# Altium schematic sheet 1.Quectel_BG96.SchDoc
size A4
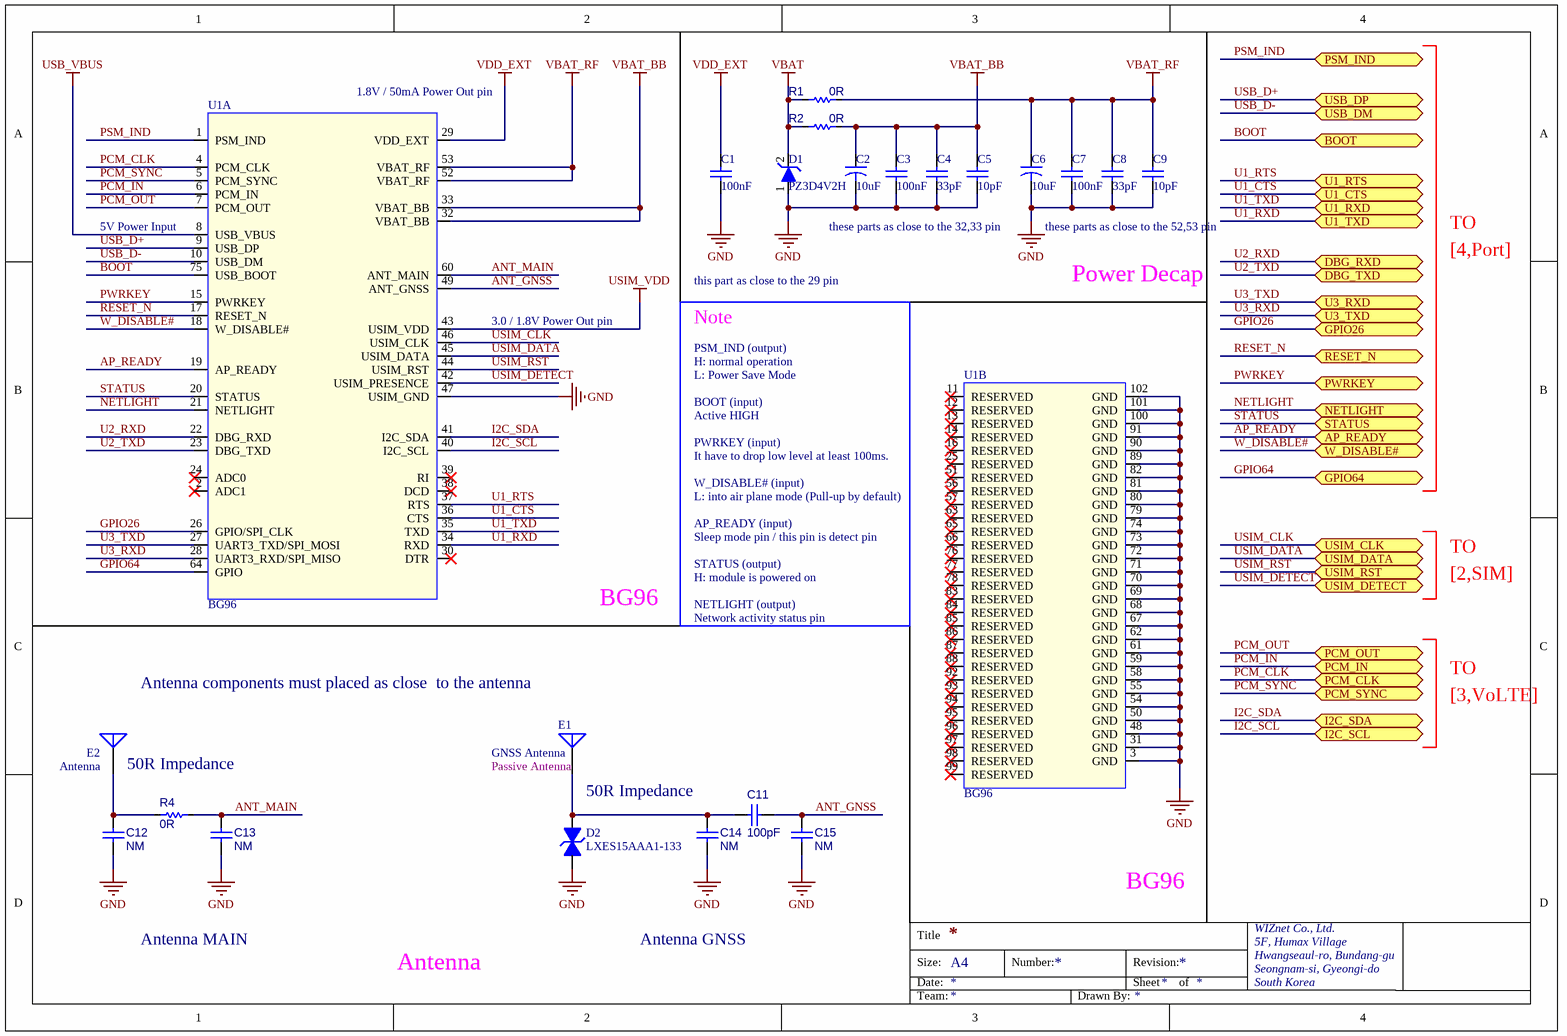
[diagram p0: 1.Quectel_BG96.SchDoc]

## Parts
C1  100nF  [CAP-0402]
C2  10uF  [CAP-1206]
C3  100nF  [CAP-0402]
C4  33pF  [CAP-0402]
C5  10pF  [CAP-0402]
C6  10uF  [CAP-1206]
C7  100nF  [CAP-0402]
C8  33pF  [CAP-0402]
C9  10pF  [CAP-0402]
C11  100pF  [CAP-0402]
C12  NM  [CAP-0402]
C13  NM  [CAP-0402]
C14  NM  [CAP-0402]
C15  NM  [CAP-0402]
D1  PZ3D4V2H  [SOD-323]
D2  LXES15AAA1-133  [D0402]
E1  GNSS Antenna  [BNC-CMJ-S01-501]
E2  Antenna  [BNC-CMJ-S01-501]
R1  0R  [RES-0402]
R2  0R  [RES-0402]
R4  0R  [RES-0402]
U1  BG96  [BG-96]  (parts A,B of 2)

## Ports
AP_READY, BOOT, DBG_RXD, DBG_TXD, GPIO26, GPIO64, I2C_SCL, I2C_SDA, NETLIGHT, PCM_CLK, PCM_IN, PCM_OUT, PCM_SYNC, PSM_IND, PWRKEY, RESET_N, STATUS, U1_CTS, U1_RTS, U1_RXD, U1_TXD, U3_RXD, U3_TXD, USB_DM, USB_DP, USIM_CLK, USIM_DATA, USIM_DETECT, USIM_RST, W_DISABLE#

## Nets
GND: C1.2 C2.2 C3.2 C4.2 C5.2 C6.2 C7.2 C8.2 C9.2 C12.2 C13.2 C14.1 C15.1 D1.1(A) D2.2 U1.3(GND) U1.31(GND) U1.47(USIM_GND) U1.48(GND) U1.50(GND) U1.54(GND) U1.55(GND) U1.58(GND) U1.59(GND) U1.61(GND) U1.62(GND) U1.67(GND) U1.68(GND) U1.69(GND) U1.70(GND) U1.71(GND) U1.72(GND) U1.73(GND) U1.74(GND) U1.79(GND) U1.80(GND) U1.81(GND) U1.82(GND) U1.89(GND) U1.90(GND) U1.91(GND) U1.100(GND) U1.101(GND) U1.102(GND)
USB_VBUS: U1.8(USB_VBUS)
USIM_VDD: U1.43(USIM_VDD)
VBAT: D1.2(K) R1.1 R2.1
VBAT_BB: C2.1 C3.1 C4.1 C5.1 R2.2 U1.32(VBAT_BB) U1.33(VBAT_BB)
VBAT_RF: C6.1 C7.1 C8.1 C9.1 R1.2 U1.52(VBAT_RF) U1.53(VBAT_RF)
VDD_EXT: C1.1 U1.29(VDD_EXT)
ANT_GNSS: C11.1 C15.2 U1.49(ANT_GNSS)
ANT_MAIN: C13.1 R4.2 U1.60(ANT_MAIN)
AP_READY: U1.19(AP_READY) ; port AP_READY
BOOT: U1.75(USB_BOOT) ; port BOOT
GPIO26: U1.26(GPIO/SPI_CLK) ; port GPIO26
GPIO64: U1.64(GPIO) ; port GPIO64
I2C_SCL: U1.40(I2C_SCL) ; port I2C_SCL
I2C_SDA: U1.41(I2C_SDA) ; port I2C_SDA
NETLIGHT: U1.21(NETLIGHT) ; port NETLIGHT
PCM_CLK: U1.4(PCM_CLK) ; port PCM_CLK
PCM_IN: U1.6(PCM_IN) ; port PCM_IN
PCM_OUT: U1.7(PCM_OUT) ; port PCM_OUT
PCM_SYNC: U1.5(PCM_SYNC) ; port PCM_SYNC
PSM_IND: U1.1(PSM_IND) ; port PSM_IND
PWRKEY: U1.15(PWRKEY) ; port PWRKEY
RESET_N: U1.17(RESET_N) ; port RESET_N
STATUS: U1.20(STATUS) ; port STATUS
U1_CTS: U1.36(CTS) ; port U1_CTS
U1_RTS: U1.37(RTS) ; port U1_RTS
U1_RXD: U1.34(RXD) ; port U1_TXD
U1_TXD: U1.35(TXD) ; port U1_RXD
U2_RXD: U1.22(DBG_RXD) ; port DBG_RXD
U2_TXD: U1.23(DBG_TXD) ; port DBG_TXD
U3_RXD: U1.28(UART3_RXD/SPI_MISO) ; port U3_TXD
U3_TXD: U1.27(UART3_TXD/SPI_MOSI) ; port U3_RXD
USB_D+: U1.9(USB_DP) ; port USB_DP
USB_D-: U1.10(USB_DM) ; port USB_DM
USIM_CLK: U1.46(USIM_CLK) ; port USIM_CLK
USIM_DATA: U1.45(USIM_DATA) ; port USIM_DATA
USIM_DETECT: U1.42(USIM_PRESENCE) ; port USIM_DETECT
USIM_RST: U1.44(USIM_RST) ; port USIM_RST
W_DISABLE#: U1.18(W_DISABLE#) ; port W_DISABLE#
NetC11_2: C11.2 C14.2 D2.1 E1.1(A)
NetC12_1: C12.1 E2.1(A) R4.1

Not connected (* = marked no-connect by the designer): U1 2(ADC1)* 11(RESERVED)* 12(RESERVED)* 13(RESERVED)* 14(RESERVED)* 16(RESERVED)* 24(ADC0)* 25(RESERVED)* 30(DTR)* 38(DCD)* 39(RI)* 51(RESERVED)* 56(RESERVED)* 57(RESERVED)* 63(RESERVED)* 65(RESERVED)* 66(RESERVED)* 76(RESERVED)* 77(RESERVED)* 78(RESERVED)* 83(RESERVED)* 84(RESERVED)* 85(RESERVED)* 86(RESERVED)* 87(RESERVED)* 88(RESERVED)* 92(RESERVED)* 93(RESERVED)* 94(RESERVED)* 95(RESERVED)* 96(RESERVED)* 97(RESERVED)* 98(RESERVED)* 99(RESERVED)*

## Notes on the sheet
- (near U1) 1.8V / 50mA Power Out pin
- (near U1) 5V Power Input
- these parts as close to the 32,33 pin
- these parts as close to the 52,53 pin
- TO
- this part as close to the 29 pin
- Power Decap
- [4,Port]
- 3.0 / 1.8V Power Out pin
- PSM_IND (output)
- H: normal operation
- L: Power Save Mode
- Note
- BOOT (input)
- Active HIGH
- PWRKEY (input)
- (near U1) It have to drop low level at least 100ms.
- W_DISABLE# (input)
- (near U1) L: into air plane mode (Pull-up by default)
- AP_READY (input)
- (near U1) Sleep mode pin / this pin is detect pin
- STATUS (output)
- H: module is powered on
- [2,SIM]
- BG96
- NETLIGHT (output)
- Network activity status pin
- Antenna components must placed as close  to the antenna
- [3,VoLTE]
- (near E2) 50R Impedance
- (near E1) Passive Antenna
- 50R Impedance
- Antenna MAIN
- Antenna
- Antenna GNSS
- Title
- Size:
- Date:
- A4
- Number:
- Revision:
- Sheet
- of
- WIZnet Co., Ltd.
- 5F, Humax Village
- Hwangseaul-ro, Bundang-gu
- Seongnam-si, Gyeongi-do
- South Korea
- Team:
- Drawn By:

## Library data of the parts
C1 C3-C5 C7-C9 = CAP-0805: Ceramic CAP 0402
C2 C6 = CAP: Electrolytic Capacitors
C11-C15 = CAP-0402: Ceramic CAP 0402(1005)
D1 = DIODE-PZ3D4V2H: Zener 5.1V
D2 = DIODE-LXES15AAA1: Bi-directional TVS diode
E1 E2 = Antenna: Generic Antenna; Published: 24-Mar-1999; LatestRevisionDate: 17-Jul-2002; LatestRevisionNote: Re-released for DXP Platform.; PackageReference: PIN1; Publisher: Altium Limited
R1 R2 R4 = RES-0402
U1 = BG96_Quectel: Quectel, BG96, LTE CAT M1 module,